# Altium schematic sheet SYSTEM.SchDoc
size B; DocumentNumber: 03; SheetNumber: 03; SheetTotal: 3
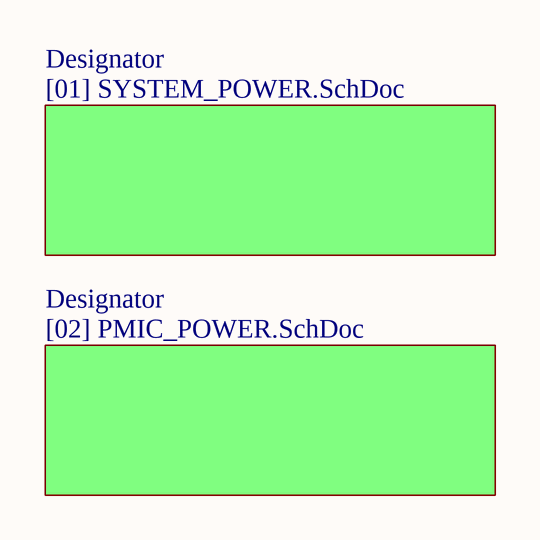
[diagram p0: SYSTEM.SchDoc]

## Sub-sheets
Designator = [01] SYSTEM_POWER.SchDoc: no entries
Designator = [02] PMIC_POWER.SchDoc: no entries